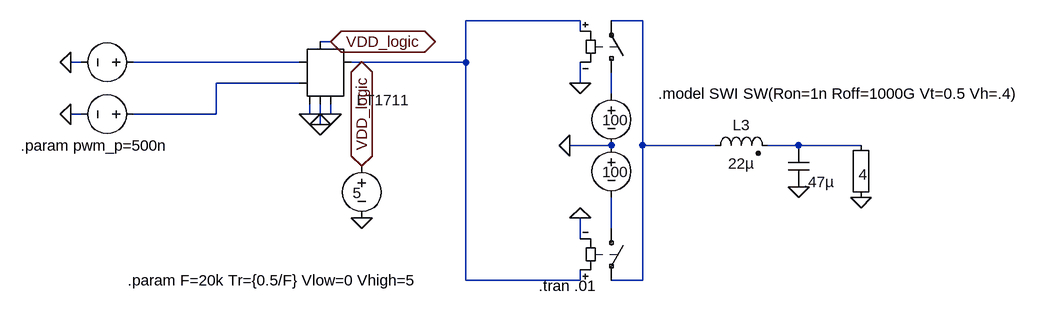
[diagram p0: schematic fuxk2.asc]
fuxk2.asc, the LTspice schematic file:
Version 4
SHEET 1 1776 680
WIRE 544 -128 368 -128
WIRE 640 -128 592 -128
WIRE 544 -112 544 -128
WIRE 160 -96 144 -96
WIRE -224 -64 -240 -64
WIRE 112 -64 -144 -64
WIRE 368 -64 368 -128
WIRE 368 -64 192 -64
WIRE 112 -32 -16 -32
WIRE 544 -32 544 -64
WIRE 592 -16 592 -48
WIRE -224 16 -240 16
WIRE -16 16 -16 -32
WIRE -16 16 -144 16
WIRE 128 16 128 0
WIRE 160 16 160 0
WIRE 144 32 144 0
WIRE 592 64 528 64
WIRE 640 64 640 -128
WIRE 752 64 640 64
WIRE 880 64 832 64
WIRE 976 64 880 64
WIRE 592 192 592 144
WIRE 544 208 544 176
WIRE 368 272 368 -64
WIRE 544 272 544 256
WIRE 544 272 368 272
WIRE 640 272 640 64
WIRE 640 272 592 272
FLAG 544 -32 0
FLAG 528 64 0
FLAG 544 176 0
FLAG 880 128 0
FLAG 976 144 0
FLAG -240 16 0
FLAG 128 16 0
FLAG 160 16 0
FLAG 144 32 0
FLAG 160 -96 VDD_logic
IOPIN 160 -96 BiDir
FLAG -240 -64 0
FLAG 208 96 VDD_logic
IOPIN 208 96 BiDir
FLAG 208 176 0
SYMBOL sw 592 -32 M180
WINDOW 0 13 4 Invisible 2
SYMATTR InstName S3
SYMATTR SpiceModel SWI
SYMATTR Value ""
SYMBOL voltage 592 48 R0
WINDOW 123 0 0 Left 2
WINDOW 0 24 16 Invisible 2
WINDOW 3 -14 57 Left 2
SYMATTR InstName V7
SYMATTR Value 100
SYMATTR SpiceLine Rser=0
SYMBOL voltage 592 -32 R0
WINDOW 123 0 0 Left 2
WINDOW 0 24 16 Invisible 2
WINDOW 3 -14 57 Left 2
SYMATTR InstName V8
SYMATTR Value 100
SYMATTR SpiceLine Rser=0
SYMBOL sw 592 176 R0
WINDOW 0 13 4 Invisible 2
SYMATTR InstName S4
SYMATTR SpiceModel SWI
SYMATTR Value ""
SYMBOL ind2 736 80 R270
WINDOW 0 32 56 VTop 2
WINDOW 3 4 56 VBottom 2
SYMATTR InstName L3
SYMATTR Value 22µ
SYMATTR SpiceLine Rser=.42
SYMATTR Type ind
SYMBOL Misc\\EuropeanCap 864 64 R0
WINDOW 0 24 4 Invisible 2
SYMATTR InstName C5
SYMATTR Value .47µ
SYMATTR SpiceLine V=400 Irms=1 Lser=0
SYMBOL Misc\\EuropeanResistor 992 48 M0
WINDOW 0 31 40 Invisible 2
WINDOW 3 6 61 Left 2
SYMATTR InstName R3
SYMATTR Value 4
SYMBOL voltage -128 16 M270
WINDOW 123 0 0 Left 2
WINDOW 0 -54 49 Invisible 2
WINDOW 3 -9 55 Invisible 2
SYMATTR InstName V3
SYMATTR Value PULSE(0 5 0 {Tr} {Tr} 0 {Tr*2})
SYMATTR SpiceLine Rser=0
SYMBOL Comparators\\LT1711 144 -48 R0
WINDOW 0 32 -40 Invisible 2
SYMATTR InstName U1
SYMBOL voltage -128 -64 M270
WINDOW 123 0 0 Left 2
WINDOW 0 -54 49 Invisible 2
WINDOW 3 -9 55 Invisible 2
SYMATTR InstName V1
SYMATTR Value SINE(2.5 2.5 1000)
SYMATTR SpiceLine Rser=0
SYMBOL voltage 208 80 R0
WINDOW 123 0 0 Left 2
WINDOW 0 24 16 Invisible 2
WINDOW 3 -14 57 Left 2
SYMATTR InstName V2
SYMATTR Value 5
SYMATTR SpiceLine Rser=0
TEXT 480 280 Left 2 !.tran .01
TEXT 664 -16 Left 2 !.model SWI SW(Ron=1n Roff=1000G Vt=0.5 Vh=.4)
TEXT -152 272 Left 2 !.param F=20k Tr={0.5/F} Vlow=0 Vhigh=5
TEXT -88 64 Right 2 !.param pwm_p=500n

The netlist it stands for:
* fuxk2.asc
S3 N005 N002 N001 0 SWI
V7 0 N007 100 Rser=0
V8 N005 0 100 Rser=0
S4 N007 N002 N001 0 SWI
L3 N002 N006 22µ Rser=.42
C5 N006 0 .47µ V=400 Irms=1 Lser=0
R3 N006 0 4
V3 N004 0 PULSE(0 5 0 {Tr} {Tr} 0 {Tr*2}) Rser=0
XU1 N004 N003 VDD_logic 0 0 N001 NC_01 0 LT1711
V1 N003 0 SINE(2.5 2.5 1000) Rser=0
V2 VDD_logic 0 5 Rser=0
.tran .01
.model SWI SW(Ron=1n Roff=1000G Vt=0.5 Vh=.4)
.param F=20k Tr={0.5/F} Vlow=0 Vhigh=5
.param pwm_p=500n
.backanno
.end